# EAGLE design SimuRain_v1.0_UNO (EAGLE 7.6.0)
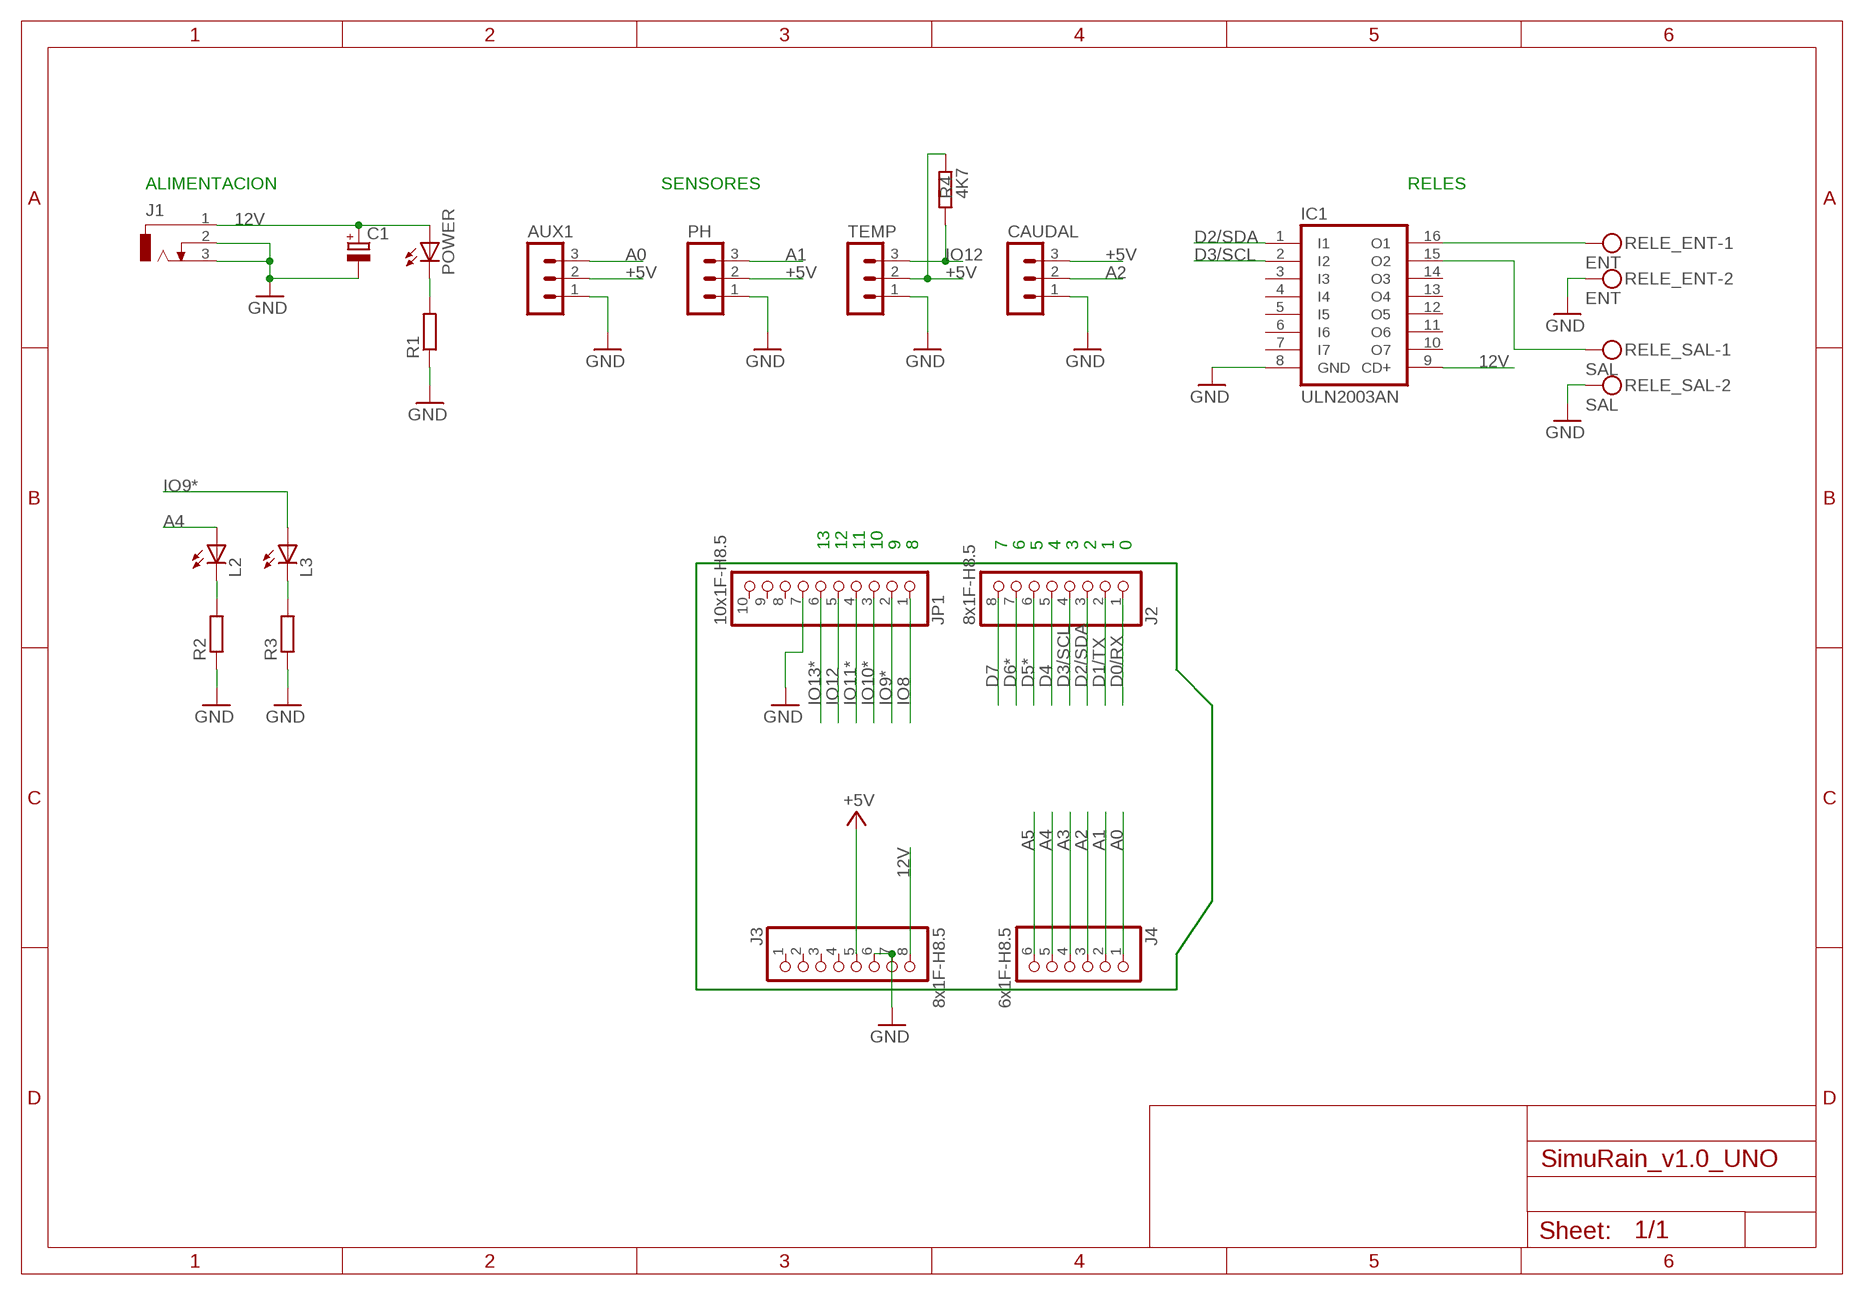
[diagram p0: schematic, sheet 1]

## Parts
AUX1  MA03-1  [MA03-1]
C1  CPOL-EUE5-6  [E5-6]
CAUDAL  MA03-1  [MA03-1]
IC1  ULN2003AN  [DIL16]
J1  DCJ0303  [DCJ0303]
J2  8x1F-H8.5  PINHD-1X8  [1X08]
J3  8x1F-H8.5  PINHD-1X8  [1X08]
J4  6x1F-H8.5  PINHD-1X6  [1X06]
JP1  10x1F-H8.5  PINHD-1X10  [1X10]
L2  LED5MM  [LED5MM]
L3  LED5MM  [LED5MM]
PH  MA03-1  [MA03-1]
POWER  LED5MM  [LED5MM]
R1  R-EU_0204/5  [0204/5]
R2  R-EU_0204/5  [0204/5]
R3  R-EU_0204/5  [0204/5]
R4  4K7  R-EU_0204/5  [0204/5]
RELE_ENT  ENT  MKDSN1,5/2-5,08  [MKDSN1,5/2-5,08]
RELE_SAL  SAL  MKDSN1,5/2-5,08  [MKDSN1,5/2-5,08]
TEMP  MA03-1  [MA03-1]

## Nets
12V: C1.+ IC1.9(CD+) J1.1 J3.8 POWER.A
+5V [usbvcc]: AUX1.2 CAUDAL.3 J3.5 PH.2 R4.2 TEMP.2
A0: AUX1.3 J4.1
A1: J4.2 PH.3
A2: CAUDAL.2 J4.3
A3: J4.4
A4: J4.5 L2.A
A5: J4.6
D0/RX: J2.1
D1/TX: J2.2
D2/SDA: IC1.1(I1) J2.3
D3/SCL: IC1.2(I2) J2.4
D4: J2.5
D5*: J2.6
D6*: J2.7
D7: J2.8
GND [gnd]: AUX1.1 C1.- CAUDAL.1 IC1.8(GND) J1.2 J1.3 J3.6 J3.7 JP1.7 PH.1 R1.1 R2.1 R3.1 RELE_ENT.2 RELE_SAL.2 TEMP.1
IO8: JP1.1
IO9*: JP1.2 L3.A
IO10*: JP1.3
IO11*: JP1.4
IO12: JP1.5 R4.1 TEMP.3
IO13*: JP1.6
N$1: IC1.16(O1) RELE_ENT.1
N$2: IC1.15(O2) RELE_SAL.1
N$3: L2.K(C) R2.2
N$4: L3.K(C) R3.2
N$9: POWER.K(C) R1.2
Unconnected: IC1.3(I3) IC1.4(I4) IC1.5(I5) IC1.6(I6) IC1.7(I7) IC1.10(O7) IC1.11(O6) IC1.12(O5) IC1.13(O4) IC1.14(O3) J3.1 J3.2 J3.3 J3.4 JP1.8 JP1.9 JP1.10

## Notes on the sheet
- ALIMENTACION | SENSORES | RELES
- 13 | 12 | 11 | 10 | 9 | 8 | 7 | 6 | 5 | 4 | 3 | 2 | 1 | 0

## Library data of the parts
AUX1 CAUDAL PH TEMP = con-lstb:MA03-1: PIN HEADER; OC_FARNELL: unknown; OC_NEWARK: unknown
C1 = rcl:CPOL-EU: POLARIZED CAPACITOR, European symbol
IC1 = uln-udn:ULN2003A: DRIVER ARRAY
J1 = con-jack:DCJ0303: DC POWER JACK Source: DCJ0303.pdf; OC_FARNELL: unknown; OC_NEWARK: unknown
J2 J3 = SmartPrj:PINHD-1X8: PIN HEADER
J4 = SmartPrj:PINHD-1X6: PIN HEADER
JP1 = SmartPrj:PINHD-1X10: PIN HEADER
L2 L3 POWER = led:LED: LED OSRAM: - CHIPLED LG R971, LG N971, LY N971, LG Q971, LY Q971, LO R971, LY R971 LH N974, LH R974 LS Q976, LO Q976, LY Q976 LO Q996 - Hyper CHIPLED LW Q18S LB Q993, LB Q99A, LB R99A - SideLED LS A670, LO A670, LY A670, LG A670, LP A670 LB A673, LV A673, LT A673, LW A673 LH A674 LY A675 LS A676, LA A676, LO A676, LY A676, LW A676 LS A679, LY A679, LG A679 - Hyper Micro SIDELED® LS Y876, LA Y876, LO Y876, LY Y876 LT Y87S - SmartLED LW L88C, LW L88S LB L89C, LB L89S, LG L890 LS L89K, LO L89K, LY L89K LS L896, LA L896, LO L896, LY L896 - TOPLED LS T670, LO T670, LY T670, LG T670, LP T670 LSG T670, LSP T670, LSY T670, LOP T670, LYG T670 LG T671, LOG T671, LSG T671 LB T673, LV T673, LT T673, LW T673 LH T674 LS T676, LA T676, LO T676, LY T676, LB T676, LH T676, LSB T676, LW T676 LB T67C, LV T67C, LT T67C, LS T67K, LO T67K, LY T67K, LW E67C LS E67B, LA E67B, LO E67B, LY E67B, LB E67C, LV E67C, LT E67C LW T67C LS T679, LY T679, LG T679 LS T770, LO T770, LY T770, LG T770, LP T770 LB T773, LV T773, LT T773, LW T773 LH T774 LS E675, LA E675, LY E675, LS T675 LS T776, LA T776, LO T776, LY T776, LB T776 LHGB T686 LT T68C, LB T68C - Hyper Mini TOPLED® LB M676 - Mini TOPLED Santana® LG M470 LS M47K, LO M47K, LY M47K Source: http://www.osram.convergy.de LUXEON: - LUMILED® LXK2-PW12-R00, LXK2-PW12-S00, LXK2-PW14-U00, LXK2-PW14-V00 LXK2-PM12-R00, LXK2-PM12-S00, LXK2-PM14-U00 LXK2-PE12-Q00, LXK2-PE12-R00, LXK2-PE12-S00, LXK2-PE14-T00, LXK2-PE14-U00 LXK2-PB12-K00, LXK2-PB12-L00, LXK2-PB12-M00, LXK2-PB14-N00, LXK2-PB14-P00, LXK2-PB14-Q00 LXK2-PR12-L00, LXK2-PR12-M00, LXK2-PR14-Q00, LXK2-PR14-R00 LXK2-PD12-Q00, LXK2-PD12-R00, LXK2-PD12-S00 LXK2-PH12-R00, LXK2-PH12-S00 LXK2-PL12-P00, LXK2-PL12-Q00, LXK2-PL12-R00 Source: www.luxeon.com KINGBRIGHT: KA-3528ASYC Source: www.kingbright.com
R1-R4 = resistor:R-EU_: RESISTOR, European symbol
RELE_ENT RELE_SAL = con-phoenix-508:MKDSN1,5/2-5,08: MKDSN 1,5/ 2-5,08 Printklemme Nennstrom: 13,5 A Nennspannung: 250 V Rastermaß: 5,08 mm Polzahl: 2 Anschlussart: Schraubanschluss Montage: Löten Anschlussrichtung Leiter/Platine: 0 ° Artikelnummer: 1729128 Source: http://eshop.phoenixcontact.com .. 1729128.pdf

## Net classes
0 default: width 0.254 mm, drill 0.61 mm, clearance 0.254 mm
1 power: width 0.254 mm, drill 0.61 mm, clearance 0.254 mm
2 gnd: width 0.254 mm, drill 0.61 mm, clearance 0.254 mm
3 usbvcc: width 0.254 mm, drill 0.61 mm, clearance 0.254 mm
4 aref: width 0.254 mm, drill 0.61 mm, clearance 0.254 mm

## Board
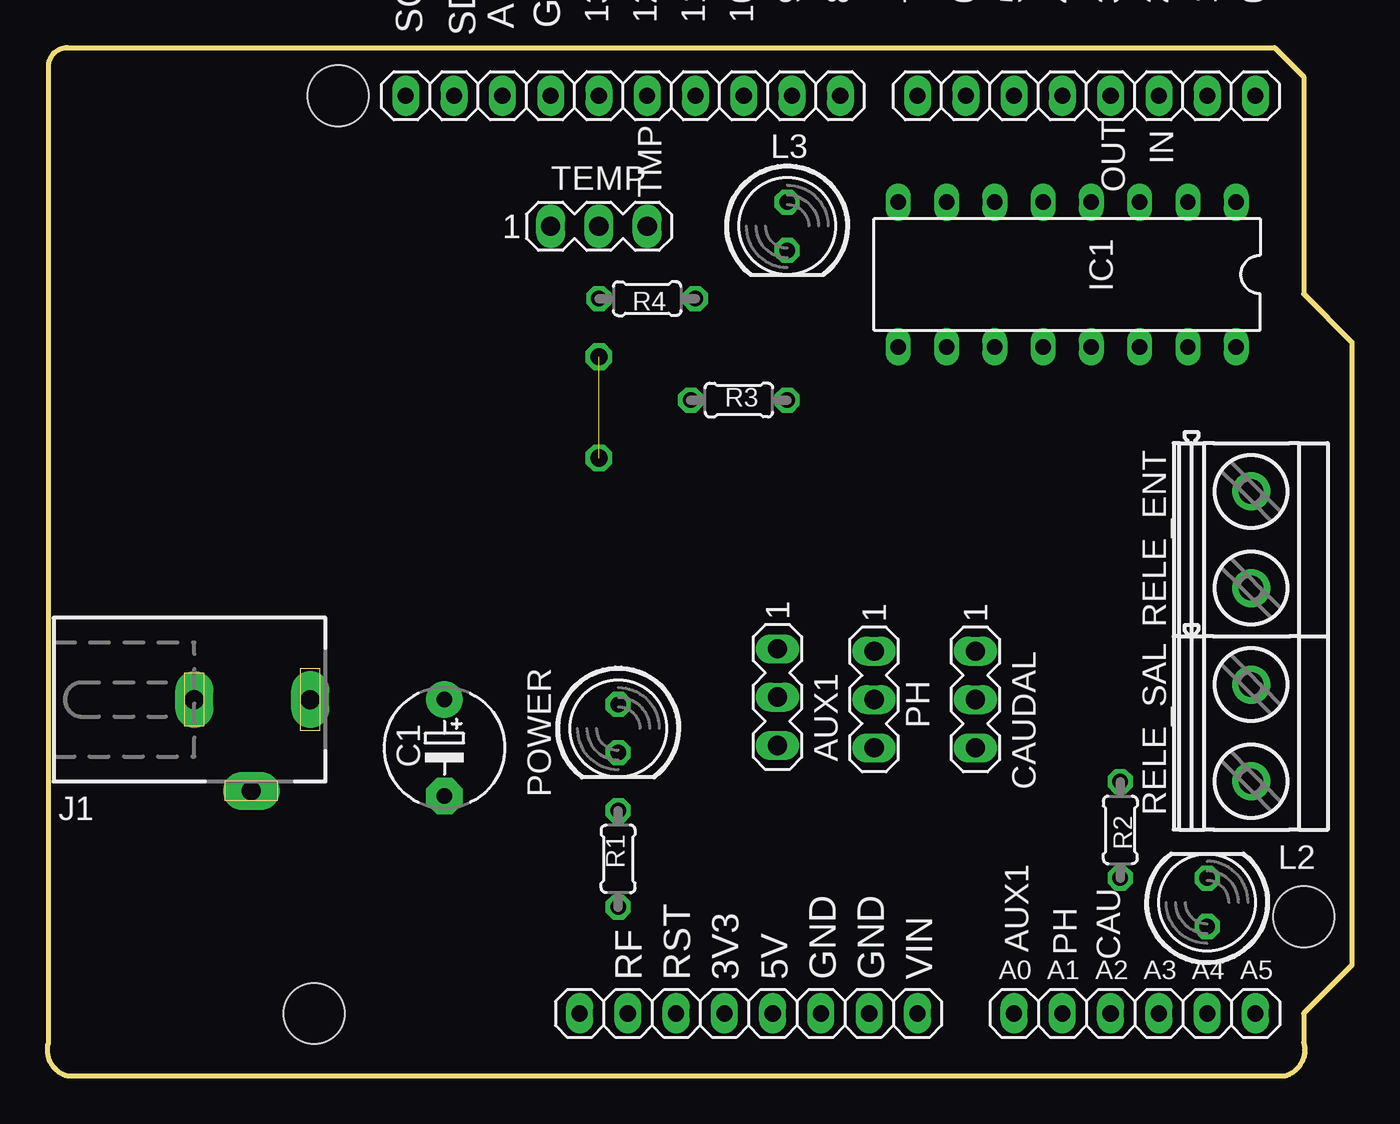
[diagram p1: board, top side]
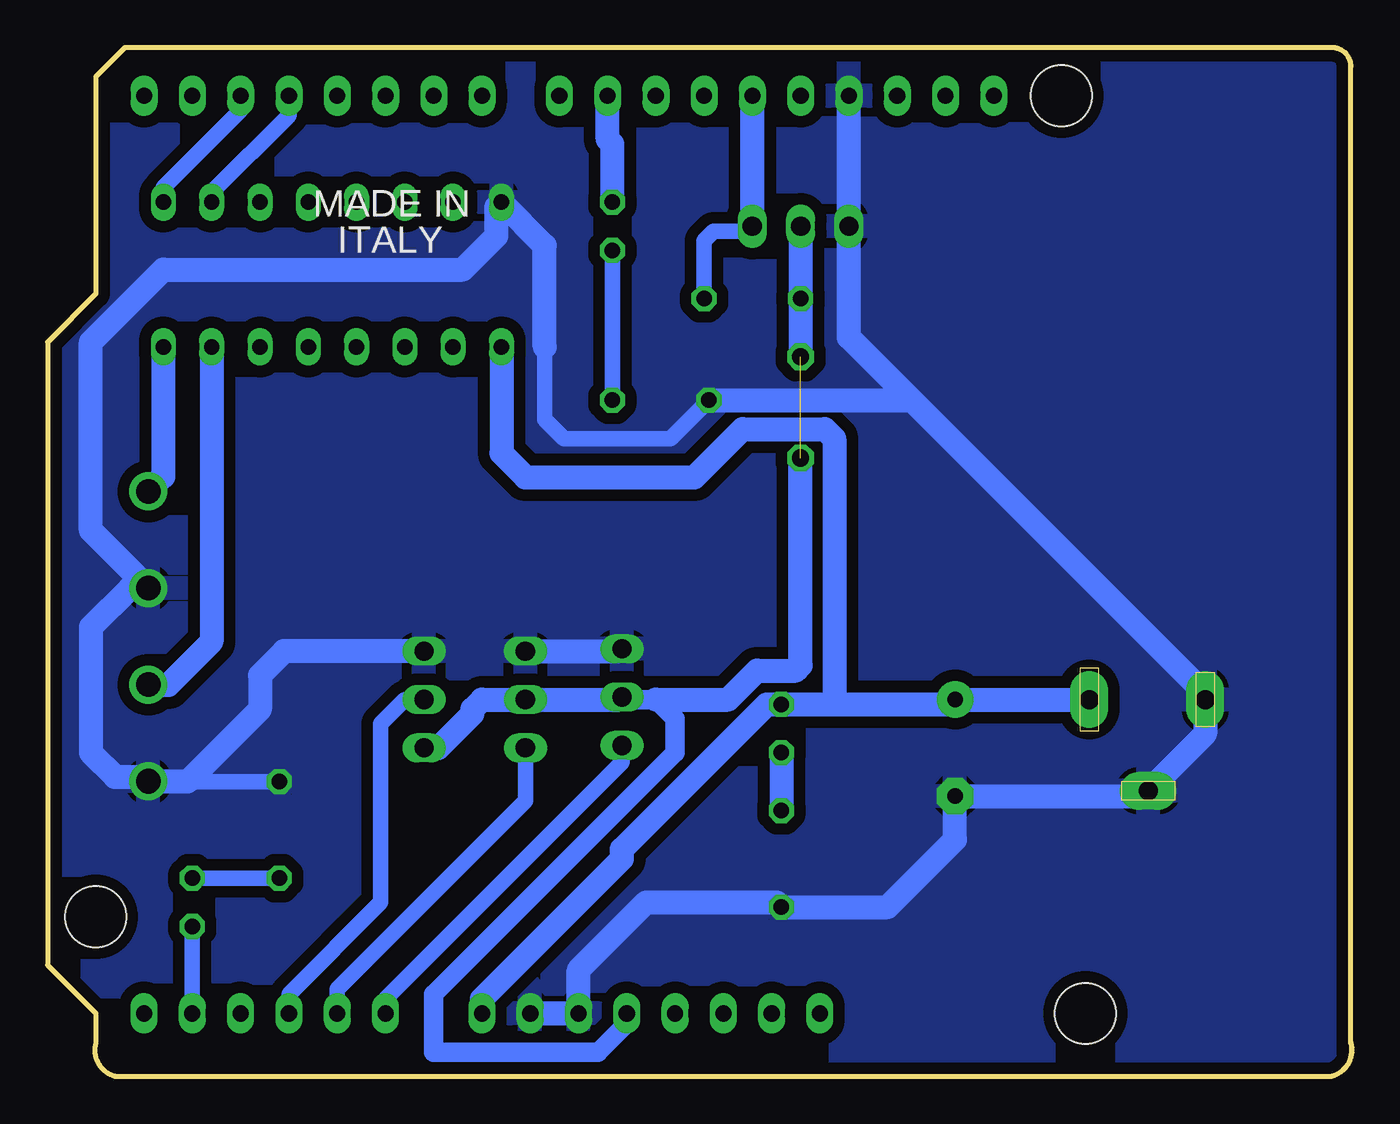
[diagram p2: board, bottom side, seen from below]

Size 68.63 x 54.1 mm. Coordinates in mm from the lower left corner, seen from the top.
Outline: 64.57,54.1 66.09,52.58 66.09,41.15 68.63,38.61 68.63,5.84 66.09,3.3 66.09,1.76 arc-90 65.09,0 1.05,0 arc-90 0.05,1.76 0.05,53.1 arc-90 1.05,54.1 64.57,54.1
Copper layers (1*16): Top 0.035mm / dielectric 1.5mm / Bottom 0.035mm
Design rules "default *": minimum track width 10mil, minimum drill 22mil, track to track 10mil, track to pad 10mil, pad to pad 8mil, via to via 12mil, smd to smd 8mil, copper to edge 10mil, drill to drill 10mil, minimum pad ring 10mil, minimum via ring 10mil, stop-mask expansion 2mil, vias tented up to drill 30mil, thermal gap 10mil
Holes 3.2 mm at 66.09,8.38 15.29,51.56 14.02,3.3
vRestrict: area 42.6,39.4 to 43.1,39.6; area 35.9,35.9 to 36.5,36.4; area 44.5,35.9 to 45.3,36.4; area 41.3,35.9 to 41.8,36.4; area 47.9,11 to 48.6,11.6; area 50.5,10.9 to 51,11.8

### Footprints (pad centres in the part's own frame; a part is rotated, then mirrored left to right if it is on the bottom)
MA03-1 = drill 1.016 long: 1 -2.54,0; 2 0,0; 3 2.54,0
E5-6 = drill 0.813 pad 1.905: + -2.54,0 | drill 0.813 pad 1.905 octagon: - 2.54,0
DIL16 = drill 0.813 long: 1 -8.89,-3.81; 2 -6.35,-3.81; 3 -3.81,-3.81; 4 -1.27,-3.81; 5 1.27,-3.81; 6 3.81,-3.81; 7 6.35,-3.81; 8 8.89,-3.81; 9 8.89,3.81; 10 6.35,3.81; 11 3.81,3.81; 12 1.27,3.81; 13 -1.27,3.81; 14 -3.81,3.81; 15 -6.35,3.81; 16 -8.89,3.81
DCJ0303 = drill 1 pad 2 long: 1 0,3.1; 2 4.8,0; 3 0,-3
1X08 = drill 0.85 pad 1.422 long: 1 -8.89,0; 2 -6.35,0; 3 -3.81,0; 4 -1.27,0; 5 1.27,0; 6 3.81,0; 7 6.35,0; 8 8.89,0
1X06 = drill 0.85 pad 1.422 long: 1 -6.35,0; 2 -3.81,0; 3 -1.27,0; 4 1.27,0; 5 3.81,0; 6 6.35,0
1X10 = drill 0.85 pad 1.422 long: 1 -11.43,0; 2 -8.89,0; 3 -6.35,0; 4 -3.81,0; 5 -1.27,0; 6 1.27,0; 7 3.81,0; 8 6.35,0; 9 8.89,0; 10 11.43,0
LED5MM = drill 0.813 octagon: A -1.27,0; K 1.27,0
0204/5 = drill 0.813 octagon: 1 -2.54,0; 2 2.54,0
MKDSN1,5/2-5,08 = drill 1.3 pad 2: 1 -2.561,0.025; 2 2.519,0.025

### Placement (x,y rotation side)
AUX1  38.41,19.94 270 top
C1  20.88,17.27 270 top
CAUDAL  48.82,19.81 270 top
IC1  53.65,42.16 180 top
J1  10.72,19.81 270 top
J2  54.66,51.56 180 top
J3  36.88,3.3 0 top
J4  57.2,3.3 0 top
JP1  30.28,51.56 180 top
L2  61.01,9.14 90 top
L3  38.91,44.7 270 top
PH  43.49,19.81 270 top
POWER  30.02,18.29 270 top
R1  30.02,11.43 90 top
R2  56.44,12.95 270 top
R3  36.37,35.56 0 top
R4  31.55,40.89 180 top
RELE_ENT  63.3,28.19 270 top
RELE_SAL  63.3,18.03 270 top
TEMP  29.01,44.7 0 top

### Tracks (layer width: path | path; a pad name or v marks a point on that pad's centre or on a via)
12V
  Bottom 1.27: 27.23,19.56 POWER.A 30.79,19.56 38.41,11.94 38.41,11.43 45.77,4.06 J3.8 | 27.23,19.56 21.13,19.56 C1.+ J1.1 | IC1.9 44.76,32.77 43.49,31.5 34.6,31.5 32.06,34.04 27.74,34.04 27.23,33.53 27.23,19.56
+5V  (1 unrouted)
  Bottom 1.016: J3.5 38.15,2.79 39.68,1.27 48.31,1.27 48.31,4.32 35.61,17.02 35.61,18.8 36.63,19.81 38.28,19.81
  Bottom 1.27: 38.28,19.81 AUX1.2 38.53,19.81 PH.2 45.77,19.81 46.28,19.3 46.28,19.05 48.06,17.27 CAUDAL.3 | 29.01,37.85 29.01,40.39 R4.2 TEMP.2 | 36.63,19.81 32.82,19.81 31.29,21.34 29.26,21.34 29.01,21.59 29.01,32.51
A0
  Bottom 0.813: AUX1.3 38.41,16.51 50.85,4.06 J4.1
A1
  Bottom 0.813: 43.49,17.02 PH.3 43.49,14.48 53.39,4.57 J4.2
A2
  Bottom 0.813: CAUDAL.2 49.84,19.81 51.11,18.54 51.11,9.14 55.93,4.32 J4.3
A4
  Bottom 0.813: L2.A J4.5
D2/SDA
  Bottom 0.813: IC1.1 62.54,46.74 58.47,50.8 J2.3
D3/SCL
  Bottom 0.813: IC1.2 60,46.48 55.93,50.55 J2.4
GND
  Bottom 0.813: R2.1 62.79,15.49 | 42.47,38.35 42.47,34.54 41.45,33.53 35.87,33.53 R3.1
  Bottom 1.27: PH.1 38.53,22.35 AUX1.1 | J3.7 J3.6 40.69,5.59 37.14,9.14 30.28,9.14 R1.1 24.44,8.89 20.88,12.45 C1.- 11,14.73 J1.2 7.72,18.01 J1.3 7.72,20.11 23.17,35.56 | CAUDAL.1 56.19,22.35 57.46,21.08 57.46,19.3 61.27,15.49 62.79,15.49 63.3,15.49 RELE_SAL.2 63.56,15.75 65.08,15.75 66.35,17.02 66.35,23.62 64.29,25.68 RELE_ENT.2 66.35,28.7 66.35,38.61 62.54,42.42 46.79,42.42 45.01,44.2 45.01,45.72 IC1.8 42.47,43.69 42.47,38.35 | JP1.7 TEMP.1 26.47,38.86 23.17,35.56 | R3.1 23.17,35.56
  pour Bottom (isolate 0.61): 0.29,54.04 69.17,54.04 69.17,-0.68 0.05,-0.68 0.05,54.2
IO9*
  Bottom 1.27: L3.A 38.91,49.02 39.17,49.28 JP1.2
IO12
  Bottom 0.813: R4.1 34.09,43.94 33.58,44.45 31.8,44.45 TEMP.3
  Bottom 1.27: TEMP.3 JP1.5
N$1
  Bottom 1.27: IC1.16 62.54,31.54 RELE_ENT.1
N$2
  Bottom 1.27: IC1.15 60,22.86 62.28,20.57 63.3,20.57 RELE_SAL.1
N$3
  Bottom 0.813: R2.2 L2.K
N$4
  Bottom 0.813: R3.2 L3.K
N$5  (via drill 0.9)
  other vias: 29.01,37.85
N$6  (via drill 0.9)
  other vias: 29.01,32.51
N$9
  Bottom 1.27: POWER.K R1.2

### Text on the board
tPlace: 13 | 12 | 11 | 10 | 9 | 8 | 7 | 6 | 5 | 4 | 3 | 2 | 1 | 0 | OUT | TMP | IN | AUX1 | CAU | PH
tNames: SCL | SDA | AREF | GND | RF | RST | 3V3 | 5V | GND | GND | VIN | A0 | A1 | A2 | A3 | A4 | A5
bNames: MADE IN | ITALY
Document: 0V | 0V | +12V | +5V | 0V
ReferenceLC: X2